# EAGLE design RS485_Mayfly (EAGLE 8.5.1)
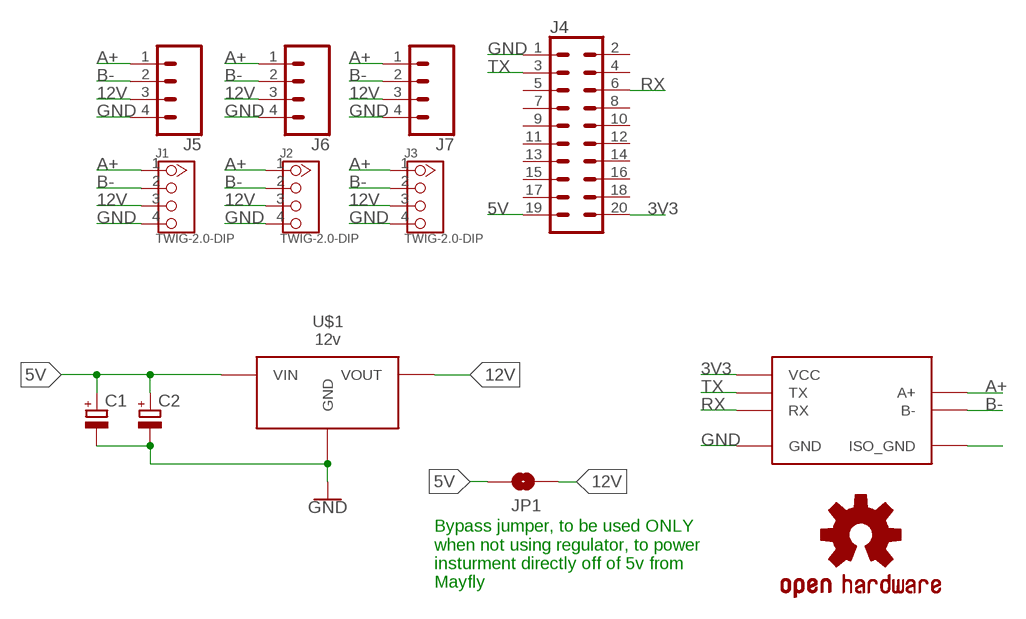
[diagram p0: schematic, sheet 1]

## Parts
C1  CPOL-EUE2,5-6E  [E2,5-6E]
C2  CPOL-EUE2,5-6E  [E2,5-6E]
J1  TWIG-2.0-DIP  [2.0_1X4]
J2  TWIG-2.0-DIP  [2.0_1X4]
J3  TWIG-2.0-DIP  [2.0_1X4]
J4  CONN_10X2  [2X10]
J5  CONN_42.54_NOSILK  [1X04_NOSILK]
J6  CONN_42.54_NOSILK  [1X04_NOSILK]
J7  CONN_42.54_NOSILK  [1X04_NOSILK]
JP1  JUMPER-SMT_2_NO_SILK  [SMT-JUMPER_2_NO_SILK]
LOGO1  OSHW-LOGOMINI  [OSHW-LOGO-MINI]
U$1  12v  POLOLU_VREG  [POLOLU_REG]
U$2  SMC_RS485  [SMC_RS485]

## Nets
3V3: J4.20 U$2.VCC
5V: C1.+ C2.+ J4.19 JP1.2 U$1.VIN
12V: J1.3 J2.3 J3.3 J5.3 J6.3 J7.3 JP1.1 U$1.VOUT
A+: J1.1 J2.1 J3.1 J5.1 J6.1 J7.1 U$2.A+
B-: J1.2 J2.2 J3.2 J5.2 J6.2 J7.2 U$2.B-
GND: C1.- C2.- J1.4 J2.4 J3.4 J4.1 J5.4 J6.4 J7.4 U$1.GND U$2.GND
N$12: U$2.GND_ISO(ISO_GND)
RX: J4.6 U$2.RX
TX: J4.3 U$2.TX
Unconnected: J4.2 J4.4 J4.5 J4.7 J4.8 J4.9 J4.10 J4.11 J4.12 J4.13 J4.14 J4.15 J4.16 J4.17 J4.18

## Notes on the sheet
- Bypass jumper, to be used ONLY
  when not using regulator, to power
  insturment directly off of 5v from
  Mayfly

## Library data of the parts
C1 C2 = bschulz_passives:CPOL-EU: POLARIZED CAPACITOR, European symbol; SPICEPREFIX: C
J1-J3 = Limnotech:TWIG-2.0-DIP
J4 = bschulz:CONN_10X2: Multi connection point. Often used as Generic Header-pin footprint for 0.1 inch spaced/style header connections On any of the 0.1 inch spaced packages, you can populate with these: Break Away Headers - Straight <https://www.sparkfun.com/products/116> (PRT-00116) Break Away Male Headers - Right Angle <https://www.sparkfun.com/products/553> (PRT-00553) Female Headers <https://www.sparkfun.com/products/115> (PRT-00115) Break Away Headers - Machine Pin <https://www.sparkfun.com/products/117> (PRT-00117) Break Away Female Headers - Swiss Machine Pin <https://www.sparkfun.com/products/743> (PRT-00743) Special note about the "SPECIAL" package: This was SPECIALLY designed to be used with our Graphic LCD Backpack. Be sure you want to use this! It is not only staggered on each line of header holes, but IT IS ALSO offset of the center point of the top and bottom lines by 5 mil. This causes the headers to lock into place on the "standard" footprint on the LCD screen. The extra squares on the tdocu layer are there simply to reference other pins (if you were to actually populate a longer header than ten long - this is what we do with the backpacks).
J5-J7 = bschulz:CONN_4: Genaric 4 pin connector
JP1 = SparkFun-Jumpers:JUMPER-SMT_2_NO: Normally open jumper This jumper has two pads in close proximity to each other. Apply solder to close the connection. Round pads are easier to solder for beginners, but are a lot larger. SparkFun Product that uses the round pads: SparkFun EL Sequencer <https://www.sparkfun.com/products/12781>
LOGO1 = SparkFun-Aesthetics:OSHW-LOGO: Open-Source Hardware (OSHW) Logo This logo indicates the piece of hardware it is found on incorporates a OSHW license and/or adheres to the definition of open source hardware found here: http://freedomdefined.org/OSHW
U$1 = Limnotech:POLOLU_VREG: Designed for connecting Pololu switch-mode voltage regulator modules For use with: U3V12F12 (12v), U3V12F9 (9v), U312F5 (5v) Make certian pinout matches before use, as come Pololu regulators have a different Vin, Vout placment!
U$2 = Limnotech:SMC_RS485: Layout for connecting SMC RS-485 module Module <https://www.amazon.com/SMAKN%C2%AE-Adapter-Serial-Converter-Module/dp/B010723BCE>

## Board
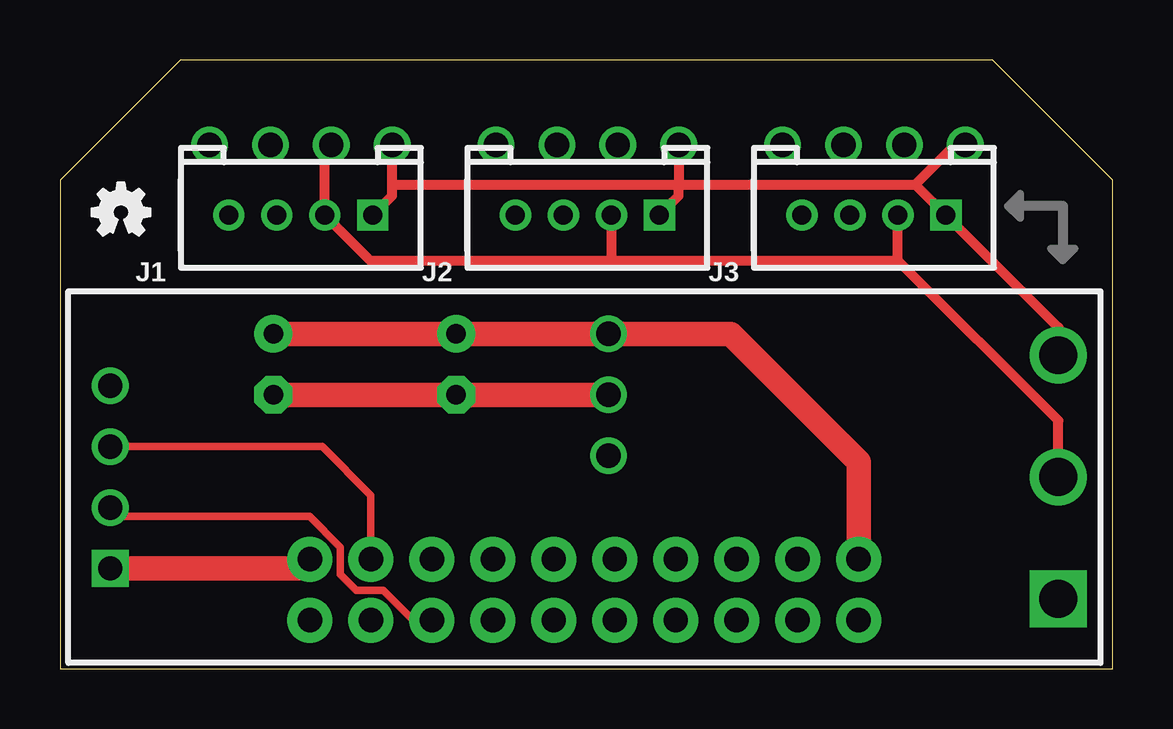
[diagram p1: board, top side]
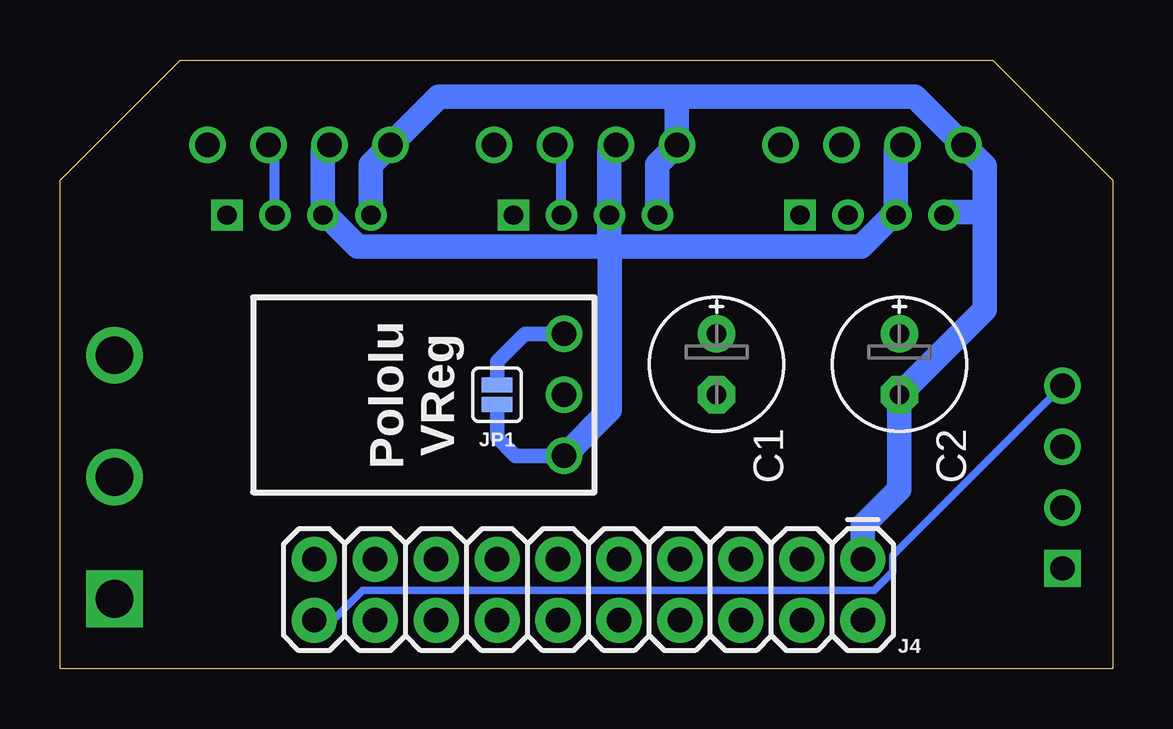
[diagram p2: board, bottom side, seen from below]

Size 43.87 x 25.39 mm. Coordinates in mm from the lower left corner, seen from the top.
Outline: 0,0 43.87,0 43.87,20.39 38.87,25.39 5,25.39 0,20.39 0,0
Copper layers (1*16): Top 0.035mm / dielectric 1.5mm / Bottom 0.035mm
Design rules "default": minimum track width 6mil, minimum drill 0.35mm, track to track 6mil, track to pad 6mil, pad to pad 6mil, via to via 6mil, smd to smd 6mil, copper to edge 40mil, drill to drill 6mil, minimum pad ring 10mil, minimum via ring 8mil, stop-mask expansion 4mil, vias tented up to drill 0mil, thermal gap 10mil

### Footprints (pad centres in the part's own frame; a part is rotated, then mirrored left to right if it is on the bottom)
E2,5-6E = drill 0.813 pad 1.575: + -1.27,0 | drill 0.813 pad 1.575 octagon: - 1.27,0
2.0_1X4 = drill 0.8 pad 1.27 square: 1 -3,0 | drill 0.8 pad 1.27: 2 -1,0; 3 1,0; 4 3,0
2X10 = drill 1.016 pad 1.88: 1 0,0; 2 0,2.54; 3 2.54,0; 4 2.54,2.54; 5 5.08,0; 6 5.08,2.54; 7 7.62,0; 8 7.62,2.54; 9 10.16,0; 10 10.16,2.54; 11 12.7,0; 12 12.7,2.54; 13 15.24,0; 14 15.24,2.54; 15 17.78,0; 16 17.78,2.54; 17 20.32,0; 18 20.32,2.54; 19 22.86,0; 20 22.86,2.54
1X04_NOSILK = drill 1.016: 1 -3.81,0; 2 -1.27,0; 3 1.27,0; 4 3.81,0
SMT-JUMPER_2_NO_SILK = smd 0.635 x 1.27: 1 -0.406,0; 2 0.406,0
POLOLU_REG = drill 1.016: GND 0,0; VIN 2.54,0; VOUT -2.54,0
SMC_RS485 = drill 1.57: A+ 19.75,5.08; B- 19.75,0 | drill 1.016 square: GND -19.75,-3.81 | drill 1.57 square: GND_ISO 19.75,-5.08 | drill 1.016: RX -19.75,-1.27; TX -19.75,1.27; VCC -19.75,3.81

### Placement (x,y rotation side)
C1  16.51,12.7 270 bottom
C2  8.89,12.7 270 bottom
J1  10.03,18.92 180 top
J2  21.97,18.92 180 top
J3  33.91,18.92 180 top
J4  10.41,4.57 180 bottom
J5  10.03,21.84 180 top
J6  21.97,21.84 180 top
J7  33.91,21.84 180 top
JP1  25.65,11.43 90 bottom
LOGO1  2.54,19.05 0 top
U$1  22.86,11.43 90 bottom
U$2  21.84,8 0 top

### Tracks (layer width: path | path; a pad name or v marks a point on that pad's centre or on a via)
3V3
  Bottom 0.305: U$2.VCC 9.17,4.74 9.17,4.06 9.95,3.28 31.25,3.28 32.49,2.03 J4.20
5V
  Top 1.016: C2.+ C1.+ U$1.VIN 27.94,13.97 33.27,8.64 J4.19
  Bottom 0.61: U$1.VIN 24.51,13.97 25.65,12.83 JP1.2
12V
  Bottom 0.61: U$1.VOUT 24.89,8.89 25.65,9.65 JP1.1
  Bottom 1.016: 20.95,17.61 10.49,17.61 9.17,18.92 J1.3 9.03,21.57 J5.3 | 20.95,17.61 31.45,17.61 32.77,18.92 J3.3 32.91,21.57 J7.3 | 20.95,17.61 20.97,17.62 J2.3 20.97,21.57 J6.3 | U$1.VOUT 20.95,10.79 20.95,17.61
A+
  Top 0.406: 35.64,20.19 J3.1 41.59,14.24 U$2.A+ | 13.84,20.19 25.78,20.19 | 25.78,20.19 35.64,20.19 | J1.1 13.84,19.73 13.84,20.19 | 13.84,20.19 J5.1 | J2.1 25.78,19.73 25.78,20.19 | J7.1 37.29,21.84 35.64,20.19 | J6.1 25.78,20.19
B-
  Top 0.406: U$2.B- 41.59,10.35 34.91,17.03 | 34.91,17.03 J3.2 | 22.99,17.03 12.92,17.03 J1.2 11.03,21.57 J5.2 | 22.99,17.03 34.91,17.03 | J2.2 22.97,17.05 22.99,17.03
  Bottom 0.406: J2.2 22.97,21.57 J6.2 | J3.2 34.91,21.57 J7.2
GND
  Top 1.016: U$1.GND C1.- C2.- | U$2.GND 10.03,4.19 J4.1
  Bottom 1.016: 5.33,19.05 5.33,14.99 C2.- 8.89,7.49 10.41,5.97 J4.1 | 5.33,19.05 5.33,20.95 J5.4 8.24,23.87 18.16,23.87 | J1.4 6.91,19.05 5.33,19.05 | 18.16,23.87 28.08,23.87 J7.4 30.91,21.03 J3.4 | 18.16,23.87 J6.4 18.97,21.03 J2.4
RX
  Top 0.305: U$2.RX 2.48,6.35 10.4,6.35 11.68,5.06 11.68,3.94 12.34,3.28 13.47,3.28 14.71,2.03 J4.6
TX
  Top 0.305: U$2.TX 10.92,9.27 12.95,7.24 J4.3

### Text on the board
tDocu: Grove Port/Screw Terminal | Mayfly | SMC / RS-485
bDocu: v1.0 | AltSoftSerial TTL to RS-485 & / powerboost for EnviroDIY Mayfly / Designed by Bobby Schulz